# Altium schematic sheet F28335_CPLD.SchDoc
size Letter; DocumentNumber: 4; SheetNumber: 4; SheetTotal: 9
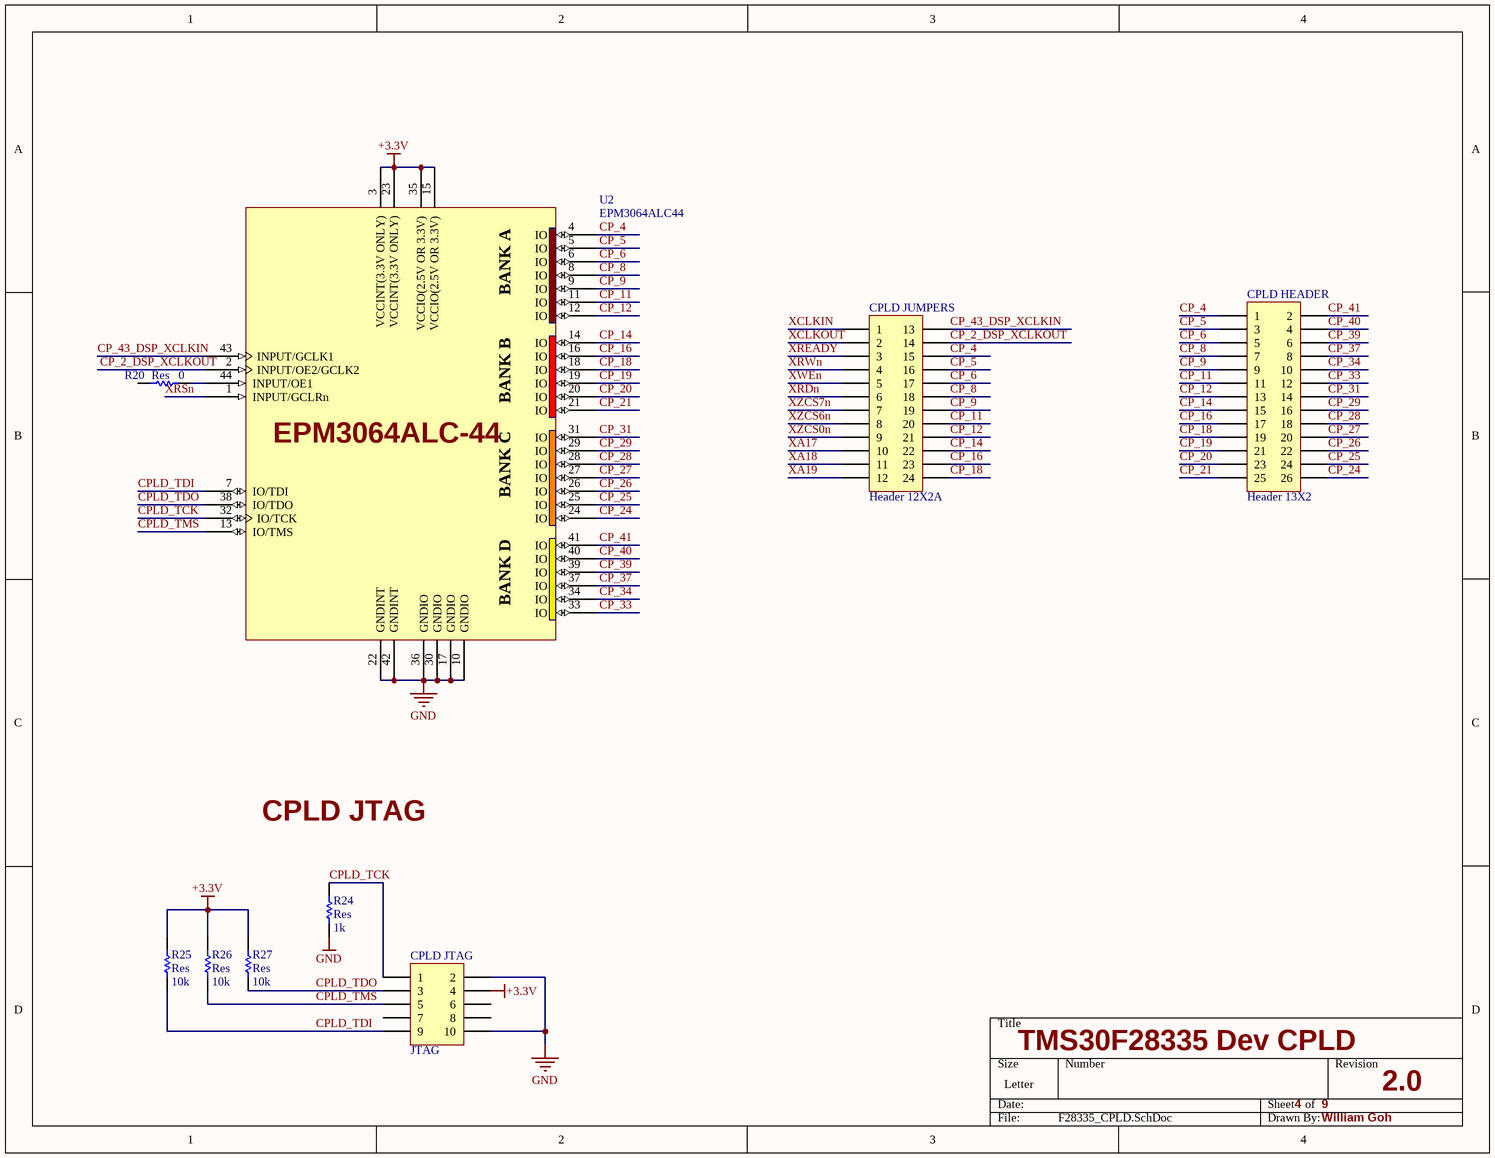
[diagram p0: F28335_CPLD.SchDoc]

## Parts
CPLD_HEADER  Header 13X2  [HDR2X13]
CPLD_JTAG  JTAG  [HDR2X5]
CPLD_JUMPERS  Header 12X2A  [HDR2X12_CEN]
R20  Res  value 0  [0805]
R24  Res  value 1k  [0805]
R25  Res  value 10k  [0805]
R26  Res  value 10k  [0805]
R27  Res  value 10k  [0805]
U2  EPM3064ALC44  [PLCC_44]

## Nets
+3.3V: CPLD_JTAG.4 R25.2 R26.2 R27.2 U2.3(VCCINT(3.3V_ONLY)) U2.15(VCCIO(2.5V_OR_3.3V)) U2.23(VCCINT(3.3V_ONLY)) U2.35(VCCIO(2.5V_OR_3.3V))
GND: CPLD_JTAG.2 CPLD_JTAG.10 R24.1 U2.10(GNDIO) U2.17(GNDIO) U2.22(GNDINT) U2.30(GNDIO) U2.36(GNDIO) U2.42(GNDINT)
CP_2_DSP_XCLKOUT: CPLD_JUMPERS.14 U2.2(INPUT/OE2/GCLK2)
CP_4: CPLD_HEADER.1 CPLD_JUMPERS.15 U2.4(IO)
CP_5: CPLD_HEADER.3 CPLD_JUMPERS.16 U2.5(IO)
CP_6: CPLD_HEADER.5 CPLD_JUMPERS.17 U2.6(IO)
CP_8: CPLD_HEADER.7 CPLD_JUMPERS.18 U2.8(IO)
CP_9: CPLD_HEADER.9 CPLD_JUMPERS.19 U2.9(IO)
CP_11: CPLD_HEADER.11 CPLD_JUMPERS.20 U2.11(IO)
CP_12: CPLD_HEADER.13 CPLD_JUMPERS.21 U2.12(IO)
CP_14: CPLD_HEADER.15 CPLD_JUMPERS.22 U2.14(IO)
CP_16: CPLD_HEADER.17 CPLD_JUMPERS.23 U2.16(IO)
CP_18: CPLD_HEADER.19 CPLD_JUMPERS.24 U2.18(IO)
CP_19: CPLD_HEADER.21 U2.19(IO)
CP_20: CPLD_HEADER.23 U2.20(IO)
CP_21: CPLD_HEADER.25 U2.21(IO)
CP_24: CPLD_HEADER.26 U2.24(IO)
CP_25: CPLD_HEADER.24 U2.25(IO)
CP_26: CPLD_HEADER.22 U2.26(IO)
CP_27: CPLD_HEADER.20 U2.27(IO)
CP_28: CPLD_HEADER.18 U2.28(IO)
CP_29: CPLD_HEADER.16 U2.29(IO)
CP_31: CPLD_HEADER.14 U2.31(IO)
CP_33: CPLD_HEADER.12 U2.33(IO)
CP_34: CPLD_HEADER.10 U2.34(IO)
CP_37: CPLD_HEADER.8 U2.37(IO)
CP_39: CPLD_HEADER.6 U2.39(IO)
CP_40: CPLD_HEADER.4 U2.40(IO)
CP_41: CPLD_HEADER.2 U2.41(IO)
CP_43_DSP_XCLKIN: CPLD_JUMPERS.13 U2.43(INPUT/GCLK1)
CPLD_TCK: CPLD_JTAG.1 R24.2 U2.32(IO/TCK)
CPLD_TDI: CPLD_JTAG.9 R25.1 U2.7(IO/TDI)
CPLD_TDO: CPLD_JTAG.3 R27.1 U2.38(IO/TDO)
CPLD_TMS: CPLD_JTAG.5 R26.1 U2.13(IO/TMS)
XA17: CPLD_JUMPERS.10
XA18: CPLD_JUMPERS.11
XA19: CPLD_JUMPERS.12
XCLKIN: CPLD_JUMPERS.1
XCLKOUT: CPLD_JUMPERS.2
XRDn: CPLD_JUMPERS.6
XREADY: CPLD_JUMPERS.3
XRSn: U2.1(INPUT/GCLRn)
XRWn: CPLD_JUMPERS.4
XWEn: CPLD_JUMPERS.5
XZCS0n: CPLD_JUMPERS.9
XZCS6n: CPLD_JUMPERS.8
XZCS7n: CPLD_JUMPERS.7
NetR20_2: R20.2 U2.44(INPUT/OE1)

Not connected (* = marked no-connect by the designer): CPLD_JTAG 6 7 8; R20 1

## Notes on the sheet
- CPLD JTAG
- TMS30F28335 Dev CPLD
- 2.0
- William Goh
- (in symbol EPM3064ALC44) BANK A; BANK B; EPM3064ALC-44; BANK C; BANK D

## Library data of the parts
CPLD_HEADER = Header 13X2: Header, 13-Pin, Dual row; LatestRevisionDate: 17-Jul-2002; LatestRevisionNote: Re-released for DXP Platform.; Publisher: Altium Limited
CPLD_JTAG = Header 5X2: Header, 5-Pin, Dual row; Revision: 17-Jul-2002: Re-released for DXP Platform.; Publisher: Altium Limited
CPLD_JUMPERS = Header 12X2A: Header, 12-Pin, Dual row; LatestRevisionDate: 17-Jul-2002; LatestRevisionNote: Re-released for DXP Platform.; Publisher: Altium Limited
R20 R24-R27 = Res Semi: Semiconductor Resistor; Published: 8-Jun-2000; LatestRevisionDate: 17-Jul-2002; LatestRevisionNote: Re-released for DXP Platform.; PackageReference: AXIAL-0.5; Publisher: Altium Limited
U2 = EPM3064ALC44: Altera MAX3000A PLCC